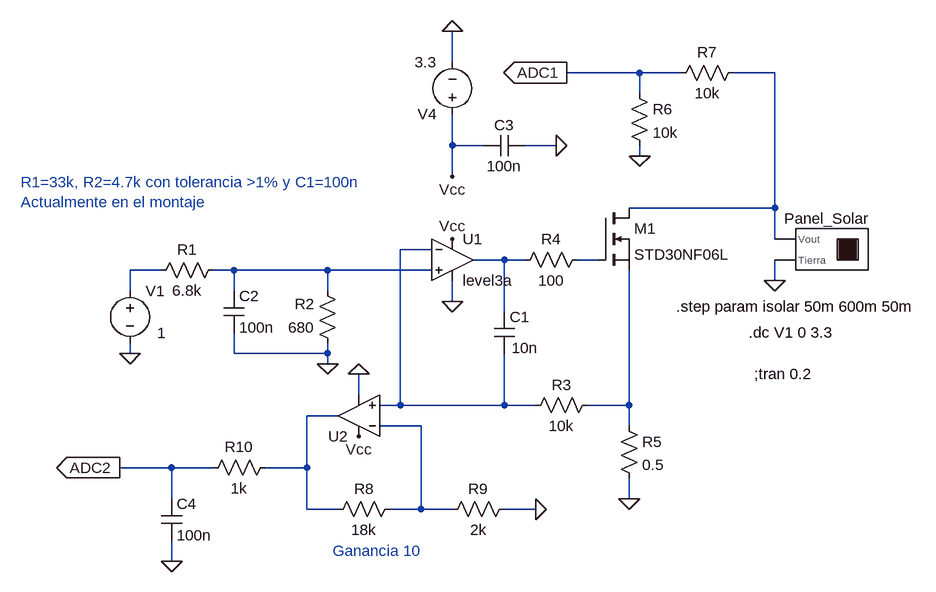
[diagram p0: schematic Carga activa.asc]
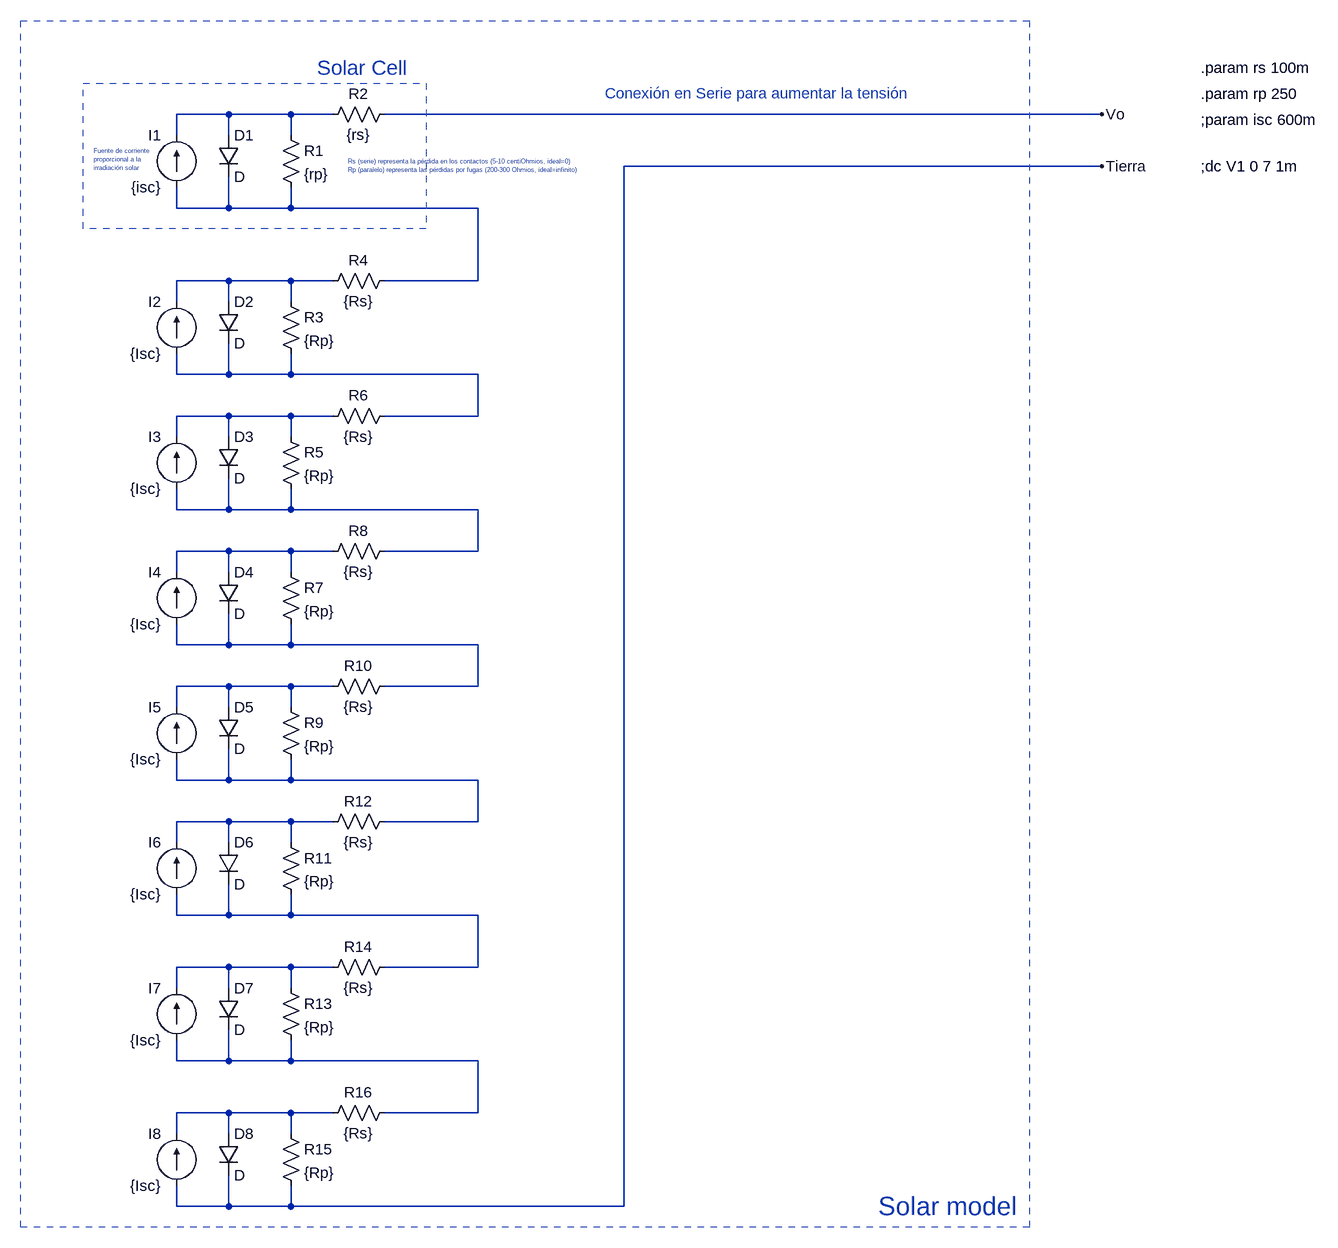
[diagram p1: sub-circuit solar_model.asc]
Carga activa.asc, the LTspice schematic file:
Version 4
SHEET 1 2576 680
WIRE 320 -208 320 -256
WIRE 608 -192 496 -192
WIRE 672 -192 608 -192
WIRE 816 -192 752 -192
WIRE 608 -160 608 -192
WIRE 320 -80 320 -128
WIRE 368 -80 320 -80
WIRE 480 -80 432 -80
WIRE 608 -64 608 -80
WIRE 320 -32 320 -80
WIRE 816 16 816 -192
WIRE 816 16 592 16
WIRE 816 64 816 16
WIRE 288 80 240 80
WIRE 400 96 352 96
WIRE 432 96 400 96
WIRE 544 96 512 96
WIRE -128 112 -176 112
WIRE -16 112 -48 112
WIRE 128 112 -16 112
WIRE 288 112 128 112
WIRE 816 128 816 96
WIRE -176 144 -176 112
WIRE -16 144 -16 112
WIRE 128 144 128 112
WIRE 320 160 320 128
WIRE 400 176 400 96
WIRE -176 240 -176 224
WIRE -16 240 -16 208
WIRE 128 240 128 224
WIRE 128 240 -16 240
WIRE 128 256 128 240
WIRE 176 304 176 272
WIRE 240 320 240 80
WIRE 240 320 208 320
WIRE 400 320 400 240
WIRE 400 320 240 320
WIRE 448 320 400 320
WIRE 592 320 592 112
WIRE 592 320 528 320
WIRE 144 336 96 336
WIRE 272 352 208 352
WIRE 592 352 592 320
WIRE -112 416 -192 416
WIRE -48 416 -112 416
WIRE 96 416 96 336
WIRE 96 416 32 416
WIRE -112 464 -112 416
WIRE 592 464 592 432
WIRE 96 480 96 416
WIRE 144 480 96 480
WIRE 272 480 272 352
WIRE 272 480 224 480
WIRE 320 480 272 480
WIRE 448 480 400 480
WIRE -112 560 -112 528
FLAG -176 240 0
FLAG 128 256 0
FLAG 816 128 0
FLAG 608 -64 0
FLAG 320 160 0
FLAG 320 -256 0
FLAG 496 -192 ADC1
IOPIN 496 -192 Out
FLAG 320 64 Vcc
FLAG 320 -32 Vcc
FLAG 448 480 0
FLAG -112 560 0
FLAG -192 416 ADC2
IOPIN -192 416 Out
FLAG 592 464 0
FLAG 176 272 0
FLAG 176 368 Vcc
FLAG 480 -80 0
SYMBOL res -32 96 R90
WINDOW 0 0 56 VBottom 2
WINDOW 3 32 56 VTop 2
SYMATTR InstName R1
SYMATTR Value 6.8k
SYMBOL res 144 240 R180
WINDOW 0 36 76 Left 2
WINDOW 3 36 40 Left 2
SYMATTR InstName R2
SYMATTR Value 680
SYMBOL voltage -176 128 R0
WINDOW 123 0 0 Left 0
WINDOW 39 0 0 Left 0
WINDOW 3 42 81 Left 2
SYMATTR Value 1
SYMATTR InstName V1
SYMBOL res 544 304 R90
WINDOW 0 0 56 VBottom 2
WINDOW 3 32 56 VTop 2
SYMATTR InstName R3
SYMATTR Value 10k
SYMBOL res 528 80 R90
WINDOW 0 0 56 VBottom 2
WINDOW 3 32 56 VTop 2
SYMATTR InstName R4
SYMATTR Value 100
SYMBOL nmos 544 16 R0
SYMATTR InstName M1
SYMATTR Value STD30NF06L
SYMBOL res 592 -176 R0
SYMATTR InstName R6
SYMATTR Value 10k
SYMBOL res 656 -176 R270
WINDOW 0 32 56 VTop 2
WINDOW 3 0 56 VBottom 2
SYMATTR InstName R7
SYMATTR Value 10k
SYMBOL voltage 320 -112 R180
WINDOW 123 0 0 Left 0
WINDOW 39 0 0 Left 0
SYMATTR InstName V4
SYMATTR Value 3.3
SYMBOL cap 384 176 R0
WINDOW 3 27 56 Left 2
SYMATTR Value 10n
SYMATTR InstName C1
SYMBOL cap -32 144 R0
SYMATTR InstName C2
SYMATTR Value 100n
SYMBOL cap 432 -96 R90
WINDOW 0 0 32 VBottom 2
WINDOW 3 32 32 VTop 2
SYMATTR InstName C3
SYMATTR Value 100n
SYMBOL res 240 464 R90
WINDOW 0 0 56 VBottom 2
WINDOW 3 32 56 VTop 2
SYMATTR InstName R8
SYMATTR Value 18k
SYMBOL res 416 464 R90
WINDOW 0 0 56 VBottom 2
WINDOW 3 32 56 VTop 2
SYMATTR InstName R9
SYMATTR Value 2k
SYMBOL res 48 400 R90
WINDOW 0 0 56 VBottom 2
WINDOW 3 32 56 VTop 2
SYMATTR InstName R10
SYMATTR Value 1k
SYMBOL cap -128 464 R0
SYMATTR InstName C4
SYMATTR Value 100n
SYMBOL res 576 336 R0
SYMATTR InstName R5
SYMATTR Value 0.5
SYMBOL Opamps\\UniversalOpamp 176 336 R180
SYMATTR InstName U2
SYMBOL Opamps\\UniversalOpamp3 320 96 R0
SYMATTR InstName U1
SYMBOL Solar_model 896 80 R0
SYMATTR InstName Panel_Solar
SYMATTR SpiceLine isc=isolar
TEXT 776 208 Left 2 !.dc V1 0 3.3
TEXT 784 272 Left 2 !;tran 0.2
TEXT 136 544 Left 2 ;Ganancia 10
TEXT 664 168 Left 2 !.step param isolar 50m 600m 50m
TEXT -344 -24 Left 2 ;R1=33k, R2=4.7k con tolerancia >1% y C1=100n\nActualmente en el montaje

solar_model.asc, the sub-circuit schematic file:
Version 4
SHEET 1 1732 1608
WIRE -192 -144 -272 -144
WIRE -96 -144 -192 -144
WIRE -32 -144 -96 -144
WIRE 1152 -144 48 -144
WIRE -272 -112 -272 -144
WIRE -192 -112 -192 -144
WIRE -96 -112 -96 -144
WIRE 1152 -64 416 -64
WIRE -272 0 -272 -32
WIRE -192 0 -192 -48
WIRE -192 0 -272 0
WIRE -96 0 -96 -32
WIRE -96 0 -192 0
WIRE 192 0 -96 0
WIRE -192 112 -272 112
WIRE -96 112 -192 112
WIRE -32 112 -96 112
WIRE 192 112 192 0
WIRE 192 112 48 112
WIRE -272 144 -272 112
WIRE -192 144 -192 112
WIRE -96 144 -96 112
WIRE -272 256 -272 224
WIRE -192 256 -192 208
WIRE -192 256 -272 256
WIRE -96 256 -96 224
WIRE -96 256 -192 256
WIRE 192 256 -96 256
WIRE -192 320 -272 320
WIRE -96 320 -192 320
WIRE -32 320 -96 320
WIRE 192 320 192 256
WIRE 192 320 48 320
WIRE -272 352 -272 320
WIRE -192 352 -192 320
WIRE -96 352 -96 320
WIRE -272 464 -272 432
WIRE -192 464 -192 416
WIRE -192 464 -272 464
WIRE -96 464 -96 432
WIRE -96 464 -192 464
WIRE 192 464 -96 464
WIRE -192 528 -272 528
WIRE -96 528 -192 528
WIRE -32 528 -96 528
WIRE 192 528 192 464
WIRE 192 528 48 528
WIRE -272 560 -272 528
WIRE -192 560 -192 528
WIRE -96 560 -96 528
WIRE -272 672 -272 640
WIRE -192 672 -192 624
WIRE -192 672 -272 672
WIRE -96 672 -96 640
WIRE -96 672 -192 672
WIRE 192 672 -96 672
WIRE -192 736 -272 736
WIRE -96 736 -192 736
WIRE -32 736 -96 736
WIRE 192 736 192 672
WIRE 192 736 48 736
WIRE -272 768 -272 736
WIRE -192 768 -192 736
WIRE -96 768 -96 736
WIRE -272 880 -272 848
WIRE -192 880 -192 832
WIRE -192 880 -272 880
WIRE -96 880 -96 848
WIRE -96 880 -192 880
WIRE 192 880 -96 880
WIRE -192 944 -272 944
WIRE -96 944 -192 944
WIRE -32 944 -96 944
WIRE 192 944 192 880
WIRE 192 944 48 944
WIRE -272 976 -272 944
WIRE -192 976 -192 944
WIRE -96 976 -96 944
WIRE -272 1088 -272 1056
WIRE -192 1088 -192 1040
WIRE -192 1088 -272 1088
WIRE -96 1088 -96 1056
WIRE -96 1088 -192 1088
WIRE 192 1088 -96 1088
WIRE -192 1168 -272 1168
WIRE -96 1168 -192 1168
WIRE -32 1168 -96 1168
WIRE 192 1168 192 1088
WIRE 192 1168 48 1168
WIRE -272 1200 -272 1168
WIRE -192 1200 -192 1168
WIRE -96 1200 -96 1168
WIRE -272 1312 -272 1280
WIRE -192 1312 -192 1264
WIRE -192 1312 -272 1312
WIRE -96 1312 -96 1280
WIRE -96 1312 -192 1312
WIRE 192 1312 -96 1312
WIRE -192 1392 -272 1392
WIRE -96 1392 -192 1392
WIRE -32 1392 -96 1392
WIRE 192 1392 192 1312
WIRE 192 1392 48 1392
WIRE -272 1424 -272 1392
WIRE -192 1424 -192 1392
WIRE -96 1424 -96 1392
WIRE -272 1536 -272 1504
WIRE -192 1536 -192 1488
WIRE -192 1536 -272 1536
WIRE -96 1536 -96 1504
WIRE -96 1536 -192 1536
WIRE 416 1536 416 -64
WIRE 416 1536 -96 1536
FLAG 1152 -144 Vo
FLAG 1152 -64 Tierra
SYMBOL current -272 -32 R180
WINDOW 0 24 80 Left 2
WINDOW 3 24 0 Left 2
WINDOW 123 0 0 Left 0
WINDOW 39 0 0 Left 0
SYMATTR InstName I1
SYMATTR Value {isc}
SYMBOL diode -208 -112 R0
SYMATTR InstName D1
SYMBOL res -112 -128 R0
SYMATTR InstName R1
SYMATTR Value {rp}
SYMBOL res 64 -160 R90
WINDOW 0 0 56 VBottom 2
WINDOW 3 32 56 VTop 2
SYMATTR InstName R2
SYMATTR Value {rs}
SYMBOL current -272 224 R180
WINDOW 0 24 80 Left 2
WINDOW 3 24 0 Left 2
WINDOW 123 0 0 Left 0
WINDOW 39 0 0 Left 0
SYMATTR InstName I2
SYMATTR Value {Isc}
SYMBOL diode -208 144 R0
SYMATTR InstName D2
SYMBOL res -112 128 R0
SYMATTR InstName R3
SYMATTR Value {Rp}
SYMBOL res 64 96 R90
WINDOW 0 0 56 VBottom 2
WINDOW 3 32 56 VTop 2
SYMATTR InstName R4
SYMATTR Value {Rs}
SYMBOL current -272 432 R180
WINDOW 0 24 80 Left 2
WINDOW 3 24 0 Left 2
WINDOW 123 0 0 Left 0
WINDOW 39 0 0 Left 0
SYMATTR InstName I3
SYMATTR Value {Isc}
SYMBOL diode -208 352 R0
SYMATTR InstName D3
SYMBOL res -112 336 R0
SYMATTR InstName R5
SYMATTR Value {Rp}
SYMBOL res 64 304 R90
WINDOW 0 0 56 VBottom 2
WINDOW 3 32 56 VTop 2
SYMATTR InstName R6
SYMATTR Value {Rs}
SYMBOL current -272 640 R180
WINDOW 0 24 80 Left 2
WINDOW 3 24 0 Left 2
WINDOW 123 0 0 Left 0
WINDOW 39 0 0 Left 0
SYMATTR InstName I4
SYMATTR Value {Isc}
SYMBOL diode -208 560 R0
SYMATTR InstName D4
SYMBOL res -112 544 R0
SYMATTR InstName R7
SYMATTR Value {Rp}
SYMBOL res 64 512 R90
WINDOW 0 0 56 VBottom 2
WINDOW 3 32 56 VTop 2
SYMATTR InstName R8
SYMATTR Value {Rs}
SYMBOL current -272 848 R180
WINDOW 0 24 80 Left 2
WINDOW 3 24 0 Left 2
WINDOW 123 0 0 Left 0
WINDOW 39 0 0 Left 0
SYMATTR InstName I5
SYMATTR Value {Isc}
SYMBOL diode -208 768 R0
SYMATTR InstName D5
SYMBOL res -112 752 R0
SYMATTR InstName R9
SYMATTR Value {Rp}
SYMBOL res 64 720 R90
WINDOW 0 0 56 VBottom 2
WINDOW 3 32 56 VTop 2
SYMATTR InstName R10
SYMATTR Value {Rs}
SYMBOL current -272 1056 R180
WINDOW 0 24 80 Left 2
WINDOW 3 24 0 Left 2
WINDOW 123 0 0 Left 0
WINDOW 39 0 0 Left 0
SYMATTR InstName I6
SYMATTR Value {Isc}
SYMBOL diode -208 976 R0
SYMATTR InstName D6
SYMBOL res -112 960 R0
SYMATTR InstName R11
SYMATTR Value {Rp}
SYMBOL res 64 928 R90
WINDOW 0 0 56 VBottom 2
WINDOW 3 32 56 VTop 2
SYMATTR InstName R12
SYMATTR Value {Rs}
SYMBOL current -272 1280 R180
WINDOW 0 24 80 Left 2
WINDOW 3 24 0 Left 2
WINDOW 123 0 0 Left 0
WINDOW 39 0 0 Left 0
SYMATTR InstName I7
SYMATTR Value {Isc}
SYMBOL diode -208 1200 R0
SYMATTR InstName D7
SYMBOL res -112 1184 R0
SYMATTR InstName R13
SYMATTR Value {Rp}
SYMBOL res 64 1152 R90
WINDOW 0 0 56 VBottom 2
WINDOW 3 32 56 VTop 2
SYMATTR InstName R14
SYMATTR Value {Rs}
SYMBOL current -272 1504 R180
WINDOW 0 24 80 Left 2
WINDOW 3 24 0 Left 2
WINDOW 123 0 0 Left 0
WINDOW 39 0 0 Left 0
SYMATTR InstName I8
SYMATTR Value {Isc}
SYMBOL diode -208 1424 R0
SYMATTR InstName D8
SYMBOL res -112 1408 R0
SYMATTR InstName R15
SYMATTR Value {Rp}
SYMBOL res 64 1376 R90
WINDOW 0 0 56 VBottom 2
WINDOW 3 32 56 VTop 2
SYMATTR InstName R16
SYMATTR Value {Rs}
TEXT 1304 -216 Left 2 !.param rs 100m
TEXT 1304 -176 Left 2 !.param rp 250
TEXT 1304 -136 Left 2 !;param isc 600m
TEXT -56 -216 Left 3 ;Solar Cell
TEXT -8 -72 Left 0 ;Rs (serie) representa la pérdida en los contactos (5-10 centiOhmios, ideal=0)\nRp (paralelo) representa las pérdidas por fugas (200-300 Ohmios, ideal=infinito)
TEXT -400 -88 Left 0 ;Fuente de corriente\nproporcional a la \nirradiación solar
TEXT 808 1536 Left 4 ;Solar model
TEXT 1304 -64 Left 2 !;dc V1 0 7 1m
TEXT 624 -192 Top 2 ;Conexión en Serie para aumentar la tensión
RECTANGLE Normal 112 32 -416 -192 1
RECTANGLE Normal 1040 1568 -512 -288 2

The netlist it stands for:
* Carga activa.asc
R1 N006 N005 6.8k
R2 0 N006 680
V1 N005 0 1
R3 N007 N002 10k
R4 N004 N003 100
M1 N001 N004 N007 N007 STD30NF06L
R6 ADC1 0 10k
R7 ADC1 N001 10k
V4 Vcc 0 3.3
C1 N003 N002 10n
C2 N006 0 100n
C3 0 Vcc 100n
R8 N009 N008 18k
R9 0 N009 2k
R10 N008 ADC2 1k
C4 ADC2 0 100n
R5 N007 0 0.5
XU2 N002 N009 Vcc 0 N008 level1 Avol=1Meg GBW=10Meg Vos=0 En=0 Enk=0 In=0 Ink=0 Rin=500Meg  ; pins In+ In- V+ V- OUT
XU1 N006 N002 Vcc 0 N003 level3a  ; pins In+ In- V+ V- OUT
XPanel_Solar N001 0 solar_model params: isc=isolar

* block symbol definitions
.subckt solar_model Vo Tierra
I1 N002 N001 {isc}
D1 N001 N002 D
R1 N001 N002 {rp}
R2 Vo N001 {rs}
I2 N004 N003 {Isc}
D2 N003 N004 D
R3 N003 N004 {Rp}
R4 N002 N003 {Rs}
I3 N006 N005 {Isc}
D3 N005 N006 D
R5 N005 N006 {Rp}
R6 N004 N005 {Rs}
I4 N008 N007 {Isc}
D4 N007 N008 D
R7 N007 N008 {Rp}
R8 N006 N007 {Rs}
I5 N010 N009 {Isc}
D5 N009 N010 D
R9 N009 N010 {Rp}
R10 N008 N009 {Rs}
I6 N012 N011 {Isc}
D6 N011 N012 D
R11 N011 N012 {Rp}
R12 N010 N011 {Rs}
I7 N014 N013 {Isc}
D7 N013 N014 D
R13 N013 N014 {Rp}
R14 N012 N013 {Rs}
I8 Tierra N015 {Isc}
D8 N015 Tierra D
R15 N015 Tierra {Rp}
R16 N014 N015 {Rs}
.param rs 100m
.param rp 250
;param isc 600m
* Solar Cell
* Rs (serie) representa la pérdida en los contactos (5-10 centiOhmios, ideal=0)
* Rp (paralelo) representa las pérdidas por fugas (200-300 Ohmios, ideal=infinito)
* Fuente de corriente
* proporcional a la
* irradiación solar
* Solar model
;dc V1 0 7 1m
* Conexión en Serie para aumentar la tensión
.ends solar_model

.model D D
.lib standard.dio
.model NMOS NMOS
.model PMOS PMOS
.lib standard.mos
.dc V1 0 3.3
;tran 0.2
* Ganancia 10
.step param isolar 50m 600m 50m
* R1=33k, R2=4.7k con tolerancia >1% y C1=100n
* Actualmente en el montaje
.lib UniversalOpAmp1.lib
.backanno
.end

* Results of the author's LTspice run, read from the files saved beside the schematic
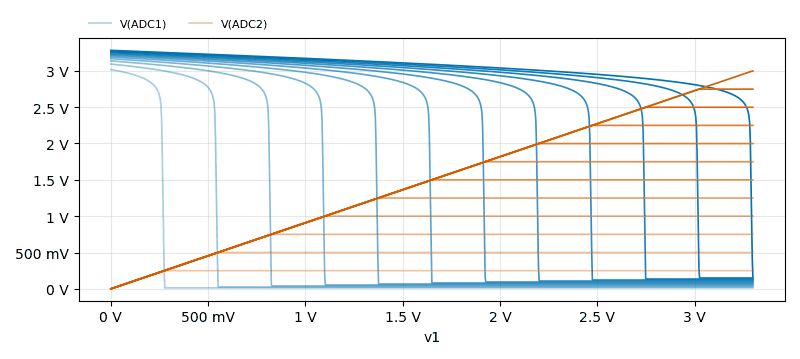
[diagram p2: DC transfer characteristic of Carga activa.asc, plotted from the saved traces]
* DC transfer characteristic, 12 runs:
*   V(ADC1) [isolar=0.05]: 3.018 V at v1=0 V, 13.48 mV at v1=3.3 V, min 13.48 mV, max 3.018 V
*   V(ADC1) [isolar=0.1]: 3.093 V at v1=0 V, 26.97 mV at v1=3.3 V, min 26.97 mV, max 3.093 V
*   V(ADC1) [isolar=0.15]: 3.136 V at v1=0 V, 40.49 mV at v1=3.3 V, min 40.49 mV, max 3.136 V
*   V(ADC1) [isolar=0.2]: 3.167 V at v1=0 V, 54.03 mV at v1=3.3 V, min 54.03 mV, max 3.167 V
*   V(ADC1) [isolar=0.25]: 3.19 V at v1=0 V, 67.6 mV at v1=3.3 V, min 67.6 mV, max 3.19 V
*   V(ADC1) [isolar=0.3]: 3.209 V at v1=0 V, 81.19 mV at v1=3.3 V, min 81.19 mV, max 3.209 V
*   V(ADC1) [isolar=0.35]: 3.225 V at v1=0 V, 94.82 mV at v1=3.3 V, min 94.82 mV, max 3.225 V
*   V(ADC1) [isolar=0.4]: 3.239 V at v1=0 V, 108.5 mV at v1=3.3 V, min 108.5 mV, max 3.239 V
*   V(ADC2) [isolar=0.05]: 600.6 µV at v1=0 V, 250.4 mV at v1=3.3 V, min 600.6 µV, max 250.4 mV
*   V(ADC2) [isolar=0.1]: 600.6 µV at v1=0 V, 500.2 mV at v1=3.3 V, min 600.6 µV, max 500.2 mV
*   V(ADC2) [isolar=0.15]: 600.6 µV at v1=0 V, 750 mV at v1=3.3 V, min 600.6 µV, max 750 mV
*   V(ADC2) [isolar=0.2]: 600.6 µV at v1=0 V, 999.9 mV at v1=3.3 V, min 600.6 µV, max 999.9 mV
*   V(ADC2) [isolar=0.25]: 600.6 µV at v1=0 V, 1.25 V at v1=3.3 V, min 600.6 µV, max 1.25 V
*   V(ADC2) [isolar=0.3]: 600.6 µV at v1=0 V, 1.499 V at v1=3.3 V, min 600.6 µV, max 1.499 V
*   V(ADC2) [isolar=0.35]: 600.6 µV at v1=0 V, 1.749 V at v1=3.3 V, min 600.6 µV, max 1.749 V
*   V(ADC2) [isolar=0.4]: 600.6 µV at v1=0 V, 1.999 V at v1=3.3 V, min 600.6 µV, max 1.999 V